# Altium schematic sheet Master MicroController.SchDoc: Master MicroController
size A4; SheetNumber: 16; SheetTotal: 37
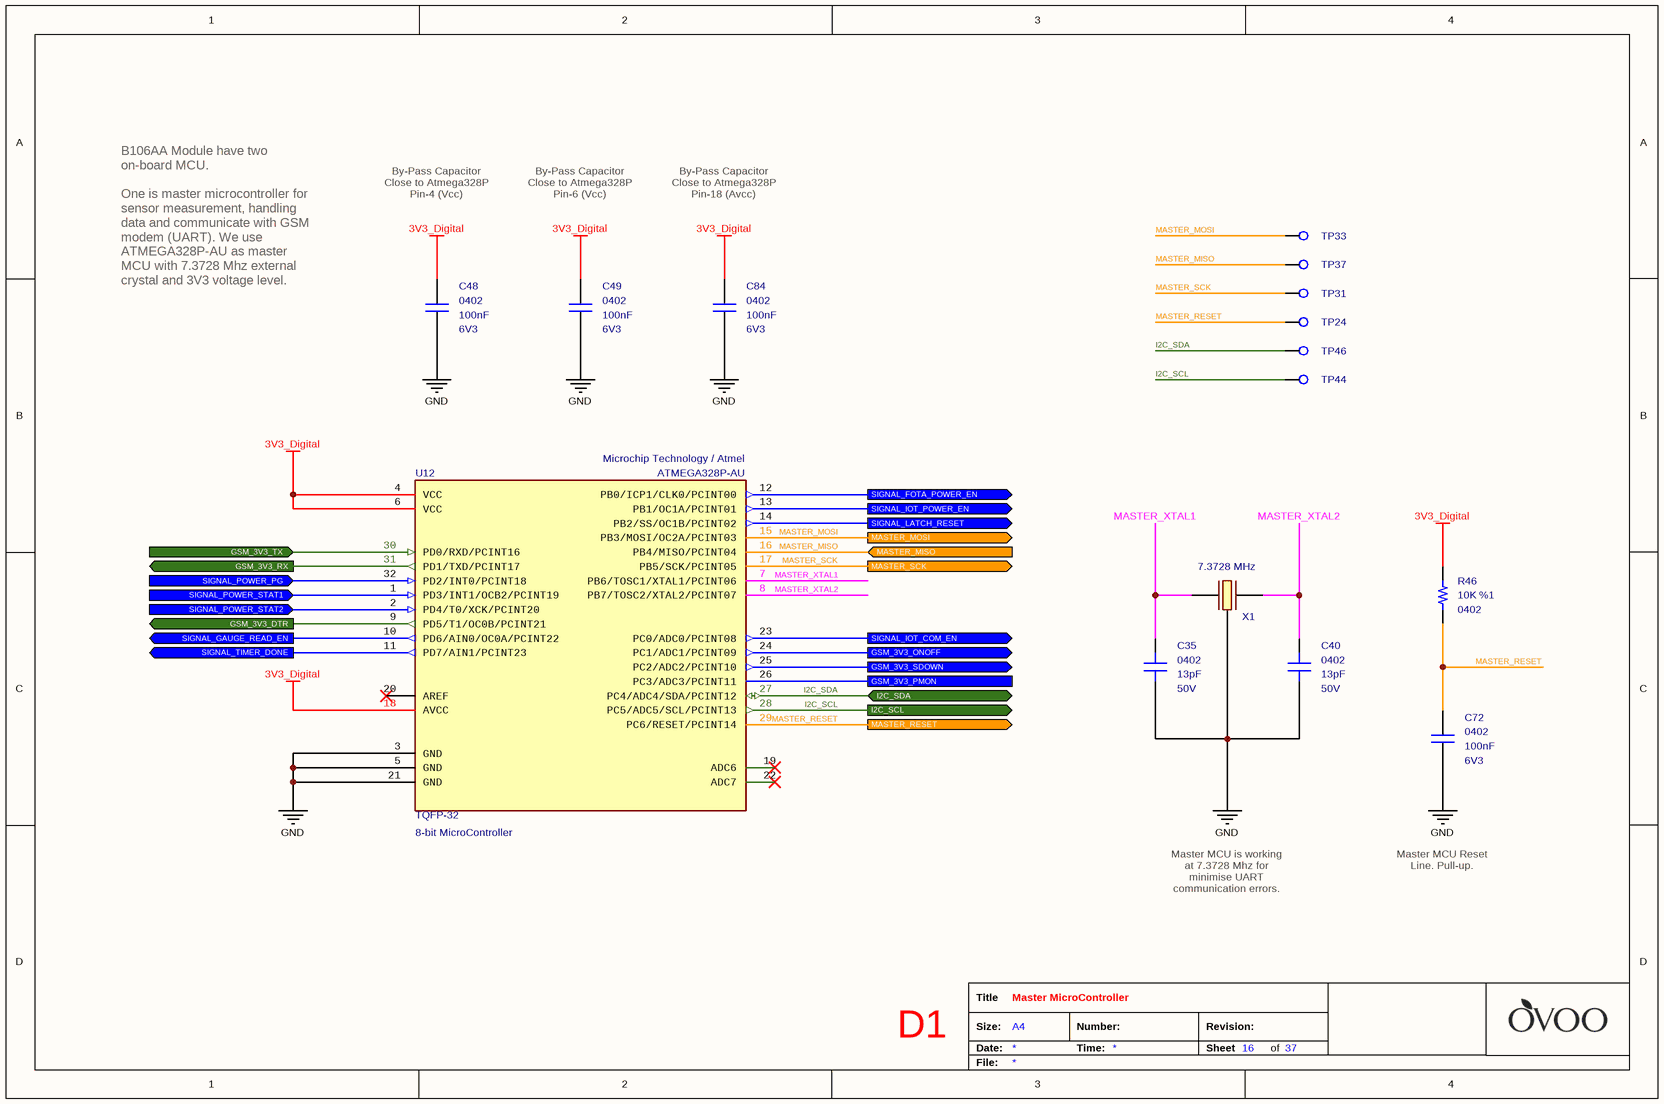
[diagram p0: Master MicroController.SchDoc]

## Parts
C35  value 13pF  Voltage: 50V  Case: 0402  [CAPACITOR_0402]  (hidden comment: Multilayer Ceramic Capacitors)
C40  value 13pF  Voltage: 50V  Case: 0402  [CAPACITOR_0402]  (hidden comment: Multilayer Ceramic Capacitors)
C48  value 100nF  Case: 0402  Voltage: 6V3  [CAPACITOR_0402]  (hidden comment: Multilayer Ceramic Capacitor)
C49  value 100nF  Case: 0402  Voltage: 6V3  [CAPACITOR_0402]  (hidden comment: Multilayer Ceramic Capacitor)
C72  value 100nF  Case: 0402  Voltage: 6V3  [CAPACITOR_0402]  (hidden comment: Multilayer Ceramic Capacitor)
C84  value 100nF  Case: 0402  Voltage: 6V3  [CAPACITOR_0402]  (hidden comment: Multilayer Ceramic Capacitor)
R46  value 10K  Tolerance: %1  Case: 0402  [RESISTOR_0402]  (hidden comment: Thick Film Resistor)
TP24  PCB - Test Point  [Test_Pad - Hole]  (value not drawn)  (no BOM)
TP31  PCB - Test Point  [Test_Pad - Hole]  (value not drawn)  (no BOM)
TP33  PCB - Test Point  [Test_Pad - Hole]  (value not drawn)  (no BOM)
TP37  PCB - Test Point  [Test_Pad - Hole]  (value not drawn)  (no BOM)
TP44  PCB - Test Point  [Test_Pad - Hole]  (value not drawn)  (no BOM)
TP46  PCB - Test Point  [Test_Pad - Hole]  (value not drawn)  (no BOM)
U12  8-bit MicroController  Manufacturer_Part_Number: ATMEGA328P-AU  Manufacturer_Name: Microchip Technology / Atmel  Case: TQFP-32  [TQFP32]
X1  7.3728 MHz  [ABRACON_CRYSTAL]

## Ports
GSM_3V3_DTR (out), GSM_3V3_ONOFF (out), GSM_3V3_PMON, GSM_3V3_RX (out), GSM_3V3_SDOWN (out), GSM_3V3_TX (in), I2C_SCL (out), I2C_SDA (bidir), MASTER_MISO (in), MASTER_MOSI (out), MASTER_RESET (out), MASTER_SCK (out), SIGNAL_FOTA_POWER_EN (out), SIGNAL_GAUGE_READ_EN (out), SIGNAL_IOT_COM_EN (out), SIGNAL_IOT_POWER_EN (out), SIGNAL_LATCH_RESET (out), SIGNAL_POWER_PG (in), SIGNAL_POWER_STAT1 (in), SIGNAL_POWER_STAT2 (in), SIGNAL_TIMER_DONE (out)

## Nets
3V3_Digital: C48.2 C49.2 C84.2 R46.2 U12.4(VCC) U12.6(VCC) U12.18(AVCC)
GND: C35.1 C40.1 C48.1 C49.1 C72.1 C84.1 U12.3(GND) U12.5(GND) U12.21(GND) X1.2(GND)
GSM_3V3_DTR: U12.9(PD5/T1/OC0B/PCINT21) ; port GSM_3V3_DTR
GSM_3V3_ONOFF: U12.24(PC1/ADC1/PCINT09) ; port GSM_3V3_ONOFF
GSM_3V3_PMON: U12.26(PC3/ADC3/PCINT11) ; port GSM_3V3_PMON
GSM_3V3_RX: U12.31(PD1/TXD/PCINT17) ; port GSM_3V3_RX
GSM_3V3_SDOWN: U12.25(PC2/ADC2/PCINT10) ; port GSM_3V3_SDOWN
GSM_3V3_TX: U12.30(PD0/RXD/PCINT16) ; port GSM_3V3_TX
I2C_SCL: TP44.1 U12.28(PC5/ADC5/SCL/PCINT13) ; port I2C_SCL
I2C_SDA: TP46.1 U12.27(PC4/ADC4/SDA/PCINT12) ; port I2C_SDA
MASTER_MISO: TP37.1 U12.16(PB4/MISO/PCINT04) ; port MASTER_MISO
MASTER_MOSI: TP33.1 U12.15(PB3/MOSI/OC2A/PCINT03) ; port MASTER_MOSI
MASTER_RESET: C72.2 R46.1 TP24.1 U12.29(PC6/RESET/PCINT14) ; port MASTER_RESET
MASTER_SCK: TP31.1 U12.17(PB5/SCK/PCINT05) ; port MASTER_SCK
MASTER_XTAL1: C35.2 U12.7(PB6/TOSC1/XTAL1/PCINT06) X1.3(OUT/IN)
MASTER_XTAL2: C40.2 U12.8(PB7/TOSC2/XTAL2/PCINT07) X1.1(IN/OUT)
SIGNAL_FOTA_POWER_EN: U12.12(PB0/ICP1/CLK0/PCINT00) ; port SIGNAL_FOTA_POWER_EN
SIGNAL_GAUGE_READ_EN: U12.10(PD6/AIN0/OC0A/PCINT22) ; port SIGNAL_GAUGE_READ_EN
SIGNAL_IOT_COM_EN: U12.23(PC0/ADC0/PCINT08) ; port SIGNAL_IOT_COM_EN
SIGNAL_IOT_POWER_EN: U12.13(PB1/OC1A/PCINT01) ; port SIGNAL_IOT_POWER_EN
SIGNAL_LATCH_RESET: U12.14(PB2/SS/OC1B/PCINT02) ; port SIGNAL_LATCH_RESET
SIGNAL_POWER_PG: U12.32(PD2/INT0/PCINT18) ; port SIGNAL_POWER_PG
SIGNAL_POWER_STAT1: U12.1(PD3/INT1/OCB2/PCINT19) ; port SIGNAL_POWER_STAT1
SIGNAL_POWER_STAT2: U12.2(PD4/T0/XCK/PCINT20) ; port SIGNAL_POWER_STAT2
SIGNAL_TIMER_DONE: U12.11(PD7/AIN1/PCINT23) ; port SIGNAL_TIMER_DONE

Not connected (* = marked no-connect by the designer): U12 19(ADC6)* 20(AREF)* 22(ADC7)*; X1 4(GND)

## Notes on the sheet
- By-Pass Capacitor
  Close to Atmega328P
  Pin-4 (Vcc)
- By-Pass Capacitor
  Close to Atmega328P
  Pin-6 (Vcc)
- By-Pass Capacitor
  Close to Atmega328P
  Pin-18 (Avcc)
- B106AA Module have two on-board MCU.
  One is master microcontroller for sensor measurement, handling data and communicate with GSM modem (UART). We use ATMEGA328P-AU as master MCU with 7.3728 Mhz external crystal and 3V3 voltage level.
- Master MCU is working at 7.3728 Mhz for minimise UART communication errors.
- Master MCU Reset Line. Pull-up.
- D1
- Title
- Size:
- Date:
- A4
- Number:
- Time:
- Revision:
- Sheet
- of
- File:

## Library data of the parts
C35 C40 = Capacitor - 13pF [0402-50V): Capacitor - 13pF [0402] (Ceramic); Manufacturer_Name: Kemet; Manufacturer_Part_Number: CBR04C130F5GAC; Dielectric: C0G; Tolerance: 1%; Height: 0.55mm; Mouser_Part_Number: 80-CBR04C130F5GAC; ROHS: Yes; Weight: 0.65mg; ComponentLink1Description: DataSheet; ComponentLink1URL: http://www.kemet.com/Lists/ProductCatalog/Attachments/490/KEM_C1030_CBR_SMD.pdf; ComponentLink2Description: Mouser; ComponentLink2URL: http://www.mouser.com/Search/ProductDetail.aspx?qs=kSX8PZDGYstn%252bRHasf81FA%3d%3d; Supplier 1: Mouser; Supplier 2: Farnell; Supplier 3: Digi-Key; Supplier Part Number 3: 399-8812-1-ND; Supplier Part Number 2: 2773390; Supplier Part Number 1: 80-CBR04C130F5GAC
C48 C49 C72 C84 = Capacitor - 100nF [0402-6V3]: Capacitor - 100nF [0402-6V3] (Ceramic); Manufacturer_Name: AVX; Manufacturer_Part_Number: 04026D104KAT4A; Dielectric: X5R; Tolerance: %10; Height: 0.25mm; Mouser_Part_Number: 581-04026D104KAT4A; ComponentLink1Description: Mouser; ComponentLink1URL: https://www.mouser.com.tr/ProductDetail/AVX/04026D104KAT4A?qs=sGAEpiMZZMs0AnBnWHyRQPg4iYkCw7IMED%2F4kpqgf7w%3D; ComponentLink2Description: DataSheet; ComponentLink2URL: https://www.mouser.com.tr/datasheet/2/40/cx5r-776519.pdf; ROHS: Yes; Maximum Operating Temperature: +85; Minimum Operating Temperature: -55; Supplier 1: Avnet; Supplier Part Number 1: 04026D104KAT4A
R46 = Resistor - 10K: Thick Film Resistors - SMD 1/16 W 10 Kohms 1%; Manufacturer_Name: Vishay; Manufacturer_Part_Number: CRCW040210K0FKED; Height: 0.4mm; Mouser_Part_Number: 71-CRCW0402-10K-E3; ComponentLink1Description: DataSheet; ComponentLink1URL: https://www.mouser.com.tr/datasheet/2/427/dcrcwe3-1762152.pdf; ComponentLink2Description: Mouser; ComponentLink2URL: https://www.mouser.com.tr/ProductDetail/Vishay-Dale/CRCW040210K0FKED?qs=sGAEpiMZZMu61qfTUdNhG2DpbjADlD3GcalbOv9utCY%3D; Supplier 1: Mouser; Supplier 2: Digi-Key; Supplier Part Number 1: 71-CRCW040210K0FKEDH; Supplier Part Number 2: 541-10.0KYCT-ND
TP24 TP31 TP33 TP37 TP44 TP46 = PCB - Test Point: Test Point
U12 = IC - ATMEGA328P: 8-bit Microcontrollers - MCU 32KB In-system Flash 20MHz 1.8V-5.5V; Supply Voltage - Min: 1.8V; Supply Voltage - Max: 5.5V; Height: 1mm; Mouser_Part_Number: 556-ATMEGA328P-AU; ComponentLink1Description: DataSheet; ComponentLink1URL: http://ww1.microchip.com/downloads/en/DeviceDoc/ATmega48A-PA-88A-PA-168A-PA-328-P-DS-DS40002061A.pdf; ROHS: Yes; Minimum Operating Temperature: -40; Maximum Operating Temperature: +85; ComponentLink2Description: Mouser; ComponentLink2URL: https://www.mouser.com.tr/ProductDetail/Microchip-Technology-Atmel/ATMEGA328P-AU?qs=sGAEpiMZZMtVoztFdqDXO3RbBx7FKCmV; ComponentLink3Description: ProductPage; ComponentLink3URL: https://www.microchip.com/wwwproducts/en/ATmega328p; Supplier 1: Avnet; Supplier 2: Mouser; Supplier 3: Arrow; Supplier 4: Digi-Key; Supplier Part Number 1: ATMEGA328P-AU; Supplier Part Number 2: 556-ATMEGA328P-AU; Supplier Part Number 3: ATMEGA328P-AU; Supplier Part Number 4: ATMEGA328P-AU-ND
X1 = Crystal - 7.3728 MHz (Abracon): Crystals 7.3728MHz 18pF -40C +85C; Manufacturer_Part_Number: ABMM2-7.3728MHZ-E2-T; ESR: 150 Ohms; Frequency Stability: 20 ppm; Height: 1.2 mm; Manufacturer_Name: ABRACON; Mouser_Part_Number: 815-ABMM2-7.3-E2-T; Frequency: 7.3728 MHz; Maximum Operating Temperature: +70; Minimum Operating Temperature: -20; ROHS: Yes; Tolerance: 20 ppm; ComponentLink1Description: DataSheet; ComponentLink1URL: https://www.ecsxtal.com/store/pdf/csm-8mr.pdf; ComponentLink2Description: Mouser; ComponentLink2URL: https://www.mouser.com/Search/Refine.aspx?Keyword=520-7.3-18-20BM-JENT; Supplier 1: Mouser; Supplier 2: Arrow; Supplier Part Number 2: ABMM2-7.3728MHZ-E2-T; Supplier Part Number 1: 815-ABMM2-7.3-E2-T